# Altium schematic sheet 05-USB-UART.SchDoc: *USBTOUART
size A3; SheetNumber: 4; SheetTotal: 4
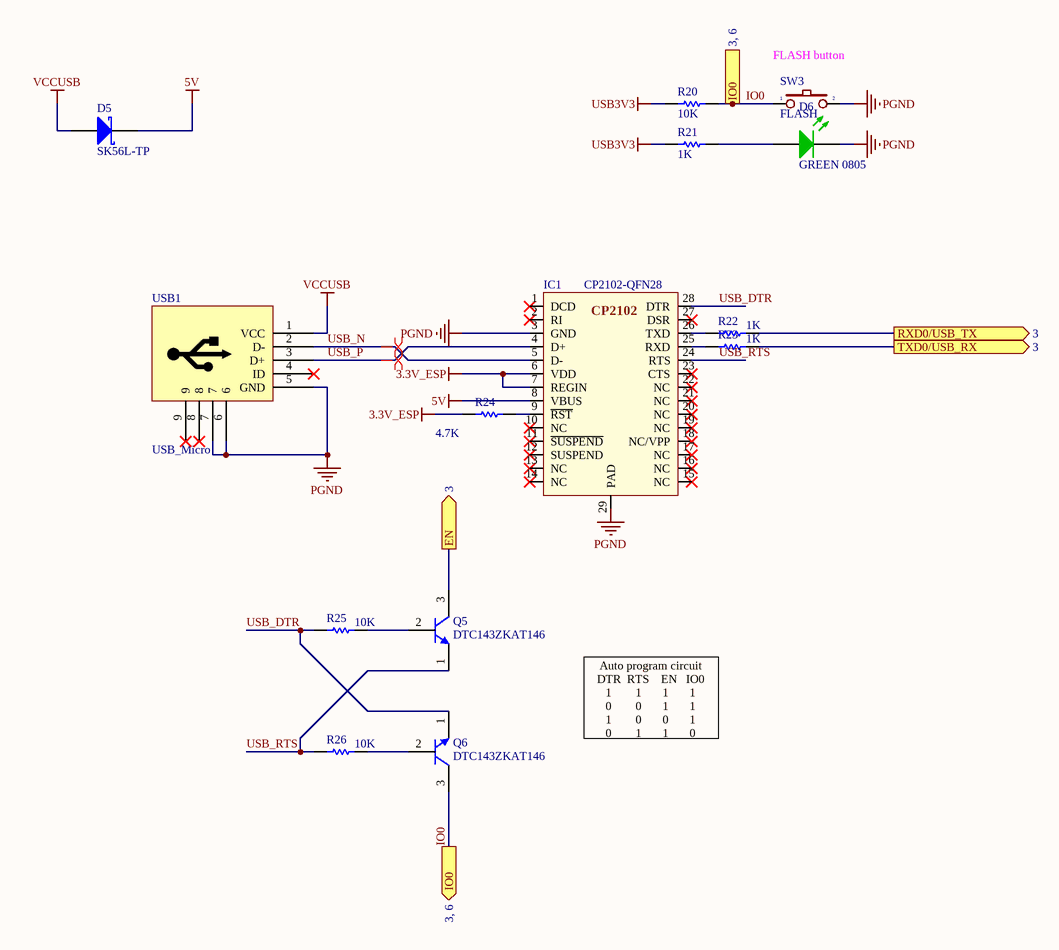
[diagram p0: 05-USB-UART.SchDoc]

## Parts
D5  SK56L-TP  [30# SK56L-TPMSCT-ND]
D6  GREEN 0805  [Led 0805G]
IC1  CP2102-QFN28  [CP2102-QFN28]
Q5  DTC143ZKAT146  [6# DTC143ZKAT146-E]
Q6  DTC143ZKAT146  [6# DTC143ZKAT146-E]
R20  10K  [Res 0805 SMD]
R21  1K  [Res 0805 SMD]
R22  1K  [Res 0805 SMD]
R23  1K  [Res 0805 SMD]
R24  4.7K  [Res 0805 SMD]
R25  10K  [Res 0805 SMD]
R26  10K  [Res 0805 SMD]
SW3  FLASH  [Button 3x4mm]
USB1  USB_Micro  [USB_MICRO_B - Digikey]

## Ports
EN (out, see 3), IO0 (out, see 3, 6), RXD0/USB_TX (out, see 3), TXD0/USB_RX (out, see 3)

## Nets
3.3V_ESP: IC1.6(VDD) IC1.7(REGIN) R24.1
5V: D5.2(K) IC1.8(VBUS)
PGND: D6.2(K) IC1.3(GND) IC1.29(PAD) SW3.2 USB1.5(GND) USB1.6 USB1.7
USB3V3: R20.1 R21.1
VCCUSB: D5.1(A) USB1.1(VCC)
EN: Q5.3(C) ; port EN
IO0: Q6.3(C) R20.2 SW3.1 ; port IO0
RXD0/USB_TX: R22.1 ; port RXD0/USB_TX
TXD0/USB_RX: R23.1 ; port TXD0/USB_RX
USB_DTR: IC1.28(DTR) Q6.1(E) R25.2
USB_N: IC1.5(D-) USB1.2(D-)
USB_P: IC1.4(D+) USB1.3(D+)
USB_RTS: IC1.24(RTS) Q5.1(E) R26.2
NetD6_1: D6.1(A) R21.2
NetIC1_9: IC1.9(~{RST}) R24.2
NetIC1_25: IC1.25(RXD) R23.2
NetIC1_26: IC1.26(TXD) R22.2
NetQ5_2: Q5.2(B) R25.1
NetQ6_2: Q6.2(B) R26.1

Not connected (* = marked no-connect by the designer): IC1 1(DCD)* 2(RI)* 10(NC)* 11(~{SUSPEND})* 12(SUSPEND)* 13(NC)* 14(NC)* 15(NC)* 16(NC)* 17(NC)* 18(NC/VPP)* 19(NC)* 20(NC)* 21(NC)* 22(NC)* 23(CTS)* 27(DSR)*; USB1 4(ID)* 8* 9*

## Layout directives
differential pair: USB_N, USB_P

## Notes on the sheet
- (near SW3) FLASH button
- Auto program circuit
  DTR  RTS    EN   IO0
  1        1       1       1
  0        0       1       1
  1        0       0       1
  0        1       1       0
- Title
- Size:
- Date:
- A3
- Number:
- Time:
- Revision:
- Sheet
- of
- File:

## Library data of the parts
D5 = 30# SK56L-TP: DIODE SCHOTTKY 60V 5A DO214AB; ComponentLink1URL: http://www.mccsemi.com/up_pdf/SK52L-SK510L(DO-214AB).PDF; ComponentLink1Description: http://www.mccsemi.com/up_pdf/SK52L-SK510L(DO-214AB).PDF; Digikey: SK56L-TPMSCT-ND
D6 = LED GREEN 0603: Green 571nm LED Indication - Discrete 2V 0805 (2012 Metric); ComponentLink1URL: http://optoelectronics.liteon.com/upload/download/DS22-2000-074/S_110_LTST-C190KGKT.pdf; ComponentLink1Description: http://optoelectronics.liteon.com/upload/download/DS22-2000-074/S_110_LTST-C190KGKT.pdf; Digikey: 160-1426-1-ND
IC1 = CP2102: USB Bridge, USB to UART USB 2.0 UART Interface 28-QFN (5x5); Digikey: 336-3694-ND; VNBuy: https://banlinhkien.vn/goods-2607-cp2102-qfn28.html
Q5 Q6 = 6#DTC143ZKAT146: Pre-Biased Bipolar Transistor (BJT) NPN - Pre-Biased 50V 100mA 250MHz 200mW Surface Mount SMT3; Digikey: DTC143ZKAT146CT-ND
R20 = 200K/R0603/1%: 10 kOhms ±1% 0.125W, 1/8W Chip Resistor 0805 (2012 Metric) Thick Film; Power (Watts): 0.1W, 1/10W; RoHS: RoHS Compliant; Category: Resistors; Part Status: Active; Features: Moisture Resistant; Operating Temperature: -55°C ~ 155°C; Package / Case: 0603 (1608 Metric); Supplier Device Package: 0603; Size / Dimension: 0.063" L x 0.031" W (1.60mm x 0.80mm); Height - Seated (Max): 0.022" (0.55mm); Failure Rate: -; ComponentLink1URL: http://www.yageo.com/documents/recent/PYu-RC_Group_51_RoHS_L_7.pdf; ComponentLink1Description: http://www.yageo.com/documents/recent/PYu-RC_Group_51_RoHS_L_7.pdf; Digikey: A126332CT-ND
R21 = 200K/R0603/1%: 1 kOhms ±1% 0.125W, 1/8W Chip Resistor 0805 (2012 Metric) Automotive AEC-Q200 Thick Film; Power (Watts): 0.1W, 1/10W; RoHS: RoHS Compliant; Category: Resistors; Part Status: Active; Features: Moisture Resistant; Operating Temperature: -55°C ~ 155°C; Package / Case: 0603 (1608 Metric); Supplier Device Package: 0603; Size / Dimension: 0.063" L x 0.031" W (1.60mm x 0.80mm); Height - Seated (Max): 0.022" (0.55mm); Failure Rate: -; ComponentLink1URL: http://www.yageo.com/documents/recent/PYu-RC_Group_51_RoHS_L_7.pdf; ComponentLink1Description: http://www.yageo.com/documents/recent/PYu-RC_Group_51_RoHS_L_7.pdf; Digikey: 541-1.00KCCT-ND
R22 R23 = 34.8K/R0805/1%: 1 kOhms ±1% 0.125W, 1/8W Chip Resistor 0805 (2012 Metric) Automotive AEC-Q200 Thick Film; Power Rating: 100mW; Resistance: 34.8kR; Voltage Rating: 50V; Case/Package: 0603; Case Code (Imperial): 0603; Case Code (Metric): 1608; Min Operating Temperature: -55°C; Max Operating Temperature: 155°C; Termination: SMD/SMT; Military Standard: Not; Voltage Rating (DC): 50V; Length: 1.6mm; Height: 0.45mm; Width: 0.8mm; Depth: 0.8mm; Lead Free: Lead Free; Digikey: 541-1.00KCCT-ND
R24 = 34.8K/R0805/1%: 4.7 kOhms ±1% 0.125W, 1/8W Chip Resistor 0805 (2012 Metric) Thick Film; Digikey: 541-4131-1-ND
R25 R26 = 34.8K/R0805/1%: 10 kOhms ±1% 0.125W, 1/8W Chip Resistor 0805 (2012 Metric) Thick Film; Power Rating: 100mW; Resistance: 34.8kR; Voltage Rating: 50V; Case/Package: 0603; Case Code (Imperial): 0603; Case Code (Metric): 1608; Min Operating Temperature: -55°C; Max Operating Temperature: 155°C; Termination: SMD/SMT; Military Standard: Not; Voltage Rating (DC): 50V; Length: 1.6mm; Height: 0.45mm; Width: 0.8mm; Depth: 0.8mm; Lead Free: Lead Free; Digikey: A126332CT-ND
SW3 = SW2: SWITCH TACTILE SPST-NO 0.05A 12V; Digikey: CKN10384CT-ND
USB1 = USB_MINI: USB - micro B USB 2.0 Receptacle Connector 5 Position Surface Mount, Right Angle; Through Hole; BuyVN: https://banlinhkien.vn/goods-5145-microusb-mk5p-dip.html; Digikey: 609-4618-1-ND